# Altium schematic sheet Power_External.SchDoc
size A4
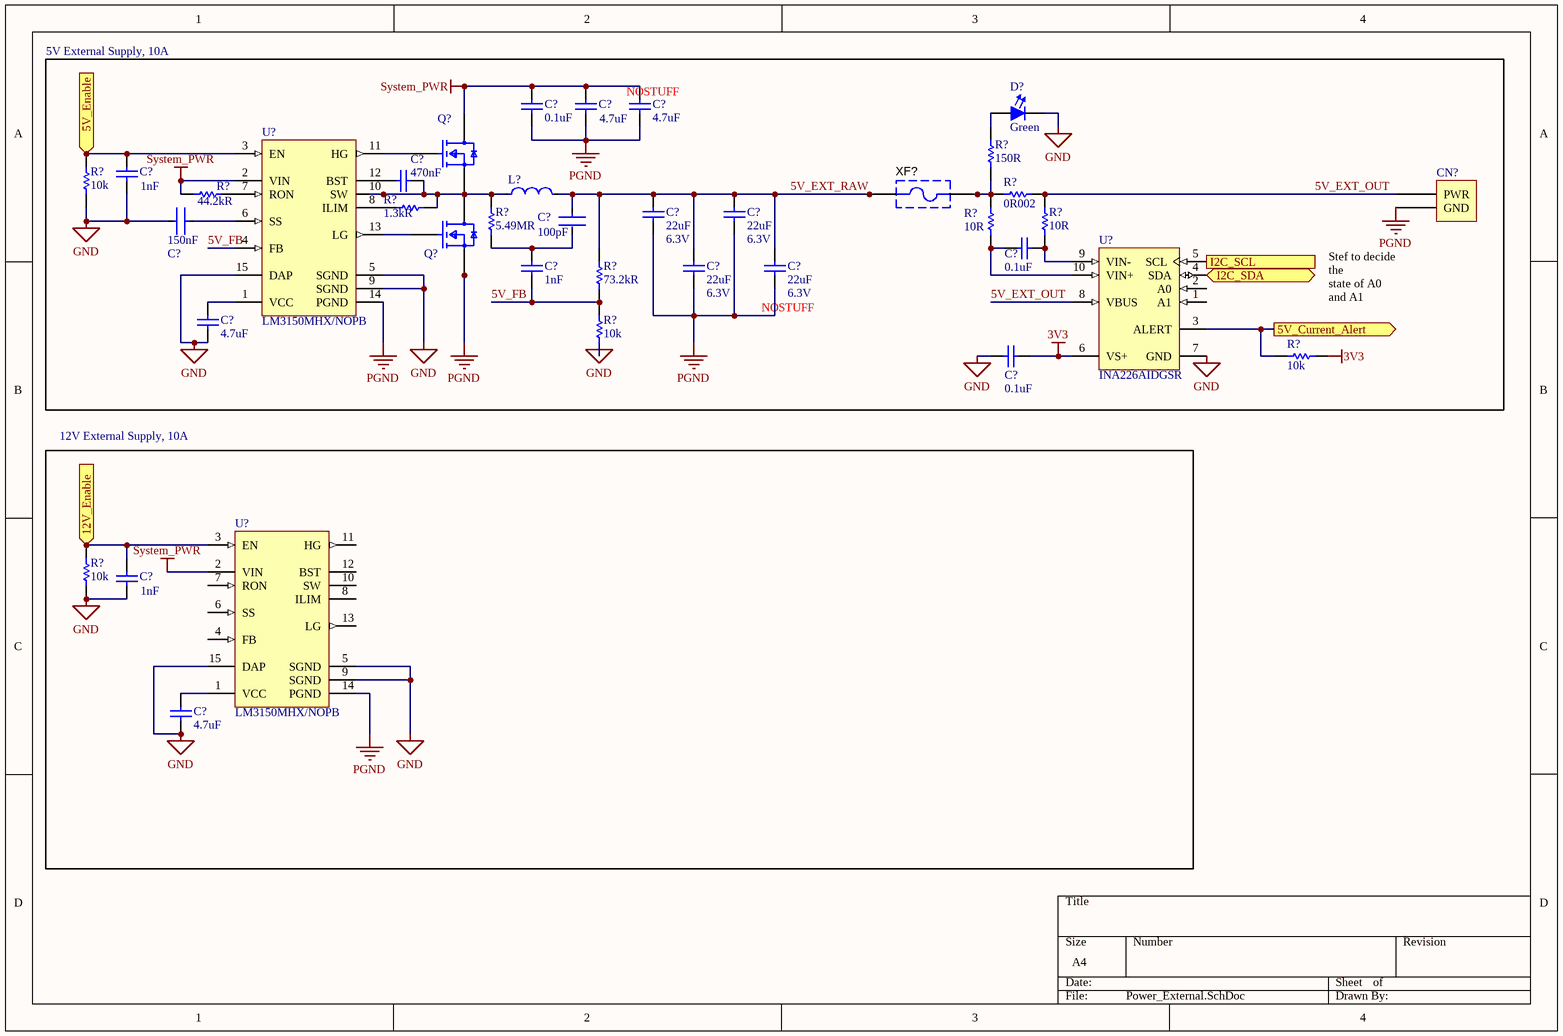
[diagram p0: Power_External.SchDoc]

## Parts
(Parts that share a designator on the sheet are numbered #1, #2 ... from top to bottom, then left to right.)
C?#1  Capacitance: 4.7uF  [CAPC3216X18N]  (hidden comment: CL31B475KBHNNNE)
C?#2  Capacitance: 4.7uF  [CAPC3216X18N]  (hidden comment: CL31B475KBHNNNE)
C?#3  Capacitance: 0.1uF  [FP-CL10-0_1-MFG]  (hidden comment: CL10B104JB8NNNC)
C?#4  Capacitance: 1nF  [CAPC1608X90X30LL10T20]  (hidden comment: CL10B102KB8NNNC)
C?#5  value 470nF  [CAPC1608N(0603")]  (hidden comment: 470nF, 50V, 10%, 0603, Ceramic, SMD)
C?#6  Capacitance: 100pF  [FP-CL10-IPC_B]  (hidden comment: CL10C101FB8NNNC)
C?#7  Capacitance: 22uF  Voltage Rating (DC): 6.3V  [CAPC1608X90X35LL10T15]  (hidden comment: GRM188R60J226MEA0D)
C?#8  Capacitance: 22uF  Voltage Rating (DC): 6.3V  [CAPC1608X90X35LL10T15]  (hidden comment: GRM188R60J226MEA0D)
C?#9  Capacitance: 150nF  [FP-CL21-IPC_B]  (hidden comment: CL21B154KBFNNNG)
C?#10  Capacitance: 0.1uF  [FP-CL10-0_1-MFG]  (hidden comment: CL10B104JB8NNNC)
C?#11  Capacitance: 22uF  Voltage Rating (DC): 6.3V  [CAPC1608X90X35LL10T15]  (hidden comment: GRM188R60J226MEA0D)
C?#12  Capacitance: 22uF  Voltage Rating (DC): 6.3V  [CAPC1608X90X35LL10T15]  (hidden comment: GRM188R60J226MEA0D)
C?#13  Capacitance: 1nF  [CAPC1608X90X30NL10T20]  (hidden comment: CL10B102KB8NNNC)
C?#14  Capacitance: 4.7uF  [CAPC3216X18N]  (hidden comment: CL31B475KBHNNNE)
C?#15  Capacitance: 0.1uF  [FP-CL10-0_1-MFG]  (hidden comment: CL10B104JB8NNNC)
C?#16  Capacitance: 1nF  [CAPC1608X90X30LL10T20]  (hidden comment: CL10B102KB8NNNC)
C?#17  Capacitance: 4.7uF  [CAPC3216X18N]  (hidden comment: CL31B475KBHNNNE)
CN?  Header, Female, 1x2, Right Angle, Pitch 0.118" (3.00mm), THT  [New footprint 1]  (value not drawn)
D?  Colour: Green  [LED0805]  (hidden comment: LED, 0805 (2012), Green, Clear)
L?  SRP1270-2R2M  [FP-SRP1270-MFG]  (value not drawn)
Q?#1  IPC50N04S5L5R5ATMA1  [FP-DQJ0008A-MFG]  (value not drawn)
Q?#2  IPC50N04S5L5R5ATMA1  [FP-DQJ0008A-MFG]  (value not drawn)
R?#1  value 10k  [RESC1608N(0603")]  (hidden comment: 10kR, 1%, 1/10W, 0603 SMD)
R?#2  Resistance: 150R  [RESC1609X50X30NL10T20]  (hidden comment: CRCW0603150RFKTA)
R?#3  Resistance: 44.2kR  [RESC1609X50X30NL10T20]  (hidden comment: CRCW060344K2FKEA)
R?#4  Resistance: 1.3kR  [RESC1609X50X30NL10T20]  (hidden comment: CRCW06031K30FKEA)
R?#5  Resistance: 5.49MR  [RESC1608N(0603")]  (hidden comment: CRCW06035M49FKEA)
R?#6  Resistance: 10R  [FP-ERJ3EK-IPC_A]  (hidden comment: ERJ3EKF10R0V)
R?#7  Resistance: 0R002  [RESC2716X08N]  (hidden comment: CSR1206-0R002F1)
R?#8  Resistance: 10R  [FP-ERJ3EK-IPC_A]  (hidden comment: ERJ3EKF10R0V)
R?#9  Resistance: 73.2kR  [RESC1608X55X30LL15T15]  (hidden comment: ERJ-3EKF7322V)
R?#10  value 10k  [RESC1608N(0603")]  (hidden comment: 10kR, 1%, 1/10W, 0603 SMD)
R?#11  value 10k  [RESC1608N(0603")]  (hidden comment: 10kR, 1%, 1/10W, 0603 SMD)
R?#12  value 10k  [RESC1608N(0603")]  (hidden comment: 10kR, 1%, 1/10W, 0603 SMD)
U?#1  LM3150MHX/NOPB  [PWP0014A_N]
U?#2  INA226AIDGSR  [DGS0010A_L]
U?#3  LM3150MHX/NOPB  [PWP0014A_N]
XF?  3557-2  [KSTN-3557-2]  (value not drawn)

## Blocks framed on the sheet
12V External Supply, 10A: C?#16 C?#17 R?#12 U?#3

## Ports
5V_Current_Alert (out), 5V_Enable (in), 12V_Enable (in), I2C_SCL (in), I2C_SDA (bidir)

## Nets
3V3: C?#15.1 R?#11.2 U?#2.6(VS+)
GND: C?#4.1 C?#9.2 C?#14.1 C?#15.2 C?#16.1 C?#17.1 D?.1(Cathode) R?#1.2 R?#10.2 R?#12.2 U?#1.5(SGND) U?#1.9(SGND) U?#1.15(DAP) U?#2.7(GND) U?#3.5(SGND) U?#3.9(SGND) U?#3.15(DAP)
PGND: C?#1.2 C?#2.2 C?#3.1 C?#7.2 C?#8.2 C?#11.2 C?#12.2 CN?.1(GND) Q?#2.1(S) Q?#2.2(S) Q?#2.3(S) U?#1.14(PGND) U?#3.14(PGND)
System_PWR: C?#1.1 C?#2.1 C?#3.2 Q?#1.5-6-7-8(D) R?#3.1 U?#1.2(VIN) U?#3.2(VIN)
5V_Current_Alert: R?#11.1 U?#2.3(ALERT) ; port 5V_Current_Alert
5V_Enable: C?#4.2 R?#1.1 U?#1.3(EN) ; port 5V_Enable
5V_EXT_OUT: CN?.2(PWR) R?#7.1 R?#8.1 U?#2.8(VBUS)
5V_EXT_RAW: C?#6.1 C?#7.1 C?#8.1 C?#11.1 C?#12.1 L?.2 R?#9.1 XF?.1 XF?.2
5V_FB: C?#13.1 R?#9.2 R?#10.1 U?#1.4(FB)
12V_Enable: C?#16.2 R?#12.1 U?#3.3(EN) ; port 12V_Enable
I2C_SCL: U?#2.5(SCL) ; port I2C_SCL
I2C_SDA: U?#2.4(SDA) ; port I2C_SDA
NetC?#5_1: C?#5.1(Anode) L?.1 Q?#1.1(S) Q?#1.2(S) Q?#1.3(S) Q?#2.5-6-7-8(D) R?#4.2 R?#5.1 U?#1.10(SW)
NetC?#5_2: C?#5.2(Cathode) U?#1.12(BST)
NetC?#6_2: C?#6.2 C?#13.2 R?#5.2
NetC?#9_1: C?#9.1 U?#1.6(SS)
NetC?#10_1: C?#10.1 R?#8.2 U?#2.9(VIN-)
NetC?#10_2: C?#10.2 R?#6.2 U?#2.10(VIN+)
NetC?#14_2: C?#14.2 U?#1.1(VCC)
NetC?#17_2: C?#17.2 U?#3.1(VCC)
NetD?_2: D?.2(Anode) R?#2.2
NetQ?#1_4: Q?#1.4(G) U?#1.11(HG)
NetQ?#2_4: Q?#2.4(G) U?#1.13(LG)
NetR?#2_1: R?#2.1 R?#6.1 R?#7.2 XF?.3 XF?.4
NetR?#3_2: R?#3.2 U?#1.7(RON)
NetR?#4_1: R?#4.1 U?#1.8(ILIM)

Not connected (* = marked no-connect by the designer): U?#2 1(A1) 2(A0); U?#3 4(FB) 6(SS) 7(RON) 8(ILIM) 10(SW) 11(HG) 12(BST) 13(LG)

## Notes on the sheet
- 5V External Supply, 10A
- (near C?#2) NOSTUFF
- (near C?#12) NOSTUFF
- Stef to decide the
  state of A0 and A1

## Library data of the parts
C?#1 C?#2 C?#14 C?#17 = CMP-00019-1: Capacitor 4.7 uF 50 VDC PU=2000 ST, CL31B475KBHNNNE, Samsung; Dielectric: X7R; Voltage: 50V; Tolerance: 10%; Thickness: 0.071inch; Case Code (Metric): 3216; Mount: Surface Mount; Packaging: Tape and Reel; Depth: 1.6mm; Package Quantity: 1; Voltage Rating: 50V; Radiation Hardening: No; Max Operating Temperature: 125°C; Min Operating Temperature: -55°C; Width: 0.063inch; Case/Package: 1206; Case Code (Imperial): 1206; Length: 3.2mm; Height: 1.6mm
C?#3 C?#10 C?#15 = CMP-00000-3: CAP CER 0.1UF 50V X7R 0603; Tolerance: 5%; Material: Ceramic; Case Code (Imperial): 0603; Mount: Surface Mount; Thickness: 0.035inch; Depth: 0.8mm; Packaging: Tape and Reel; Package Quantity: 1; Dielectric: X7R; Height: 0.8mm; Voltage: 50V; Radiation Hardening: No; Max Operating Temperature: 125°C; Voltage Rating: 50V; Case/Package: 0603; Min Operating Temperature: -55°C; Case Code (Metric): 1608; Length: 1.6mm; Contact Plating: Tin; Width: 0.031inch
C?#4 C?#13 C?#16 = CMP-00018-1: Cap Ceramic 0.001uF 50V X7R 10% Pad SMD 0603 125°C T/R; Tolerance: 10%; Case Code (Imperial): 0603; Packaging: Tape and Reel; Dielectric: X7R; Thickness: 0.035inch; Contact Plating: Tin; Min Operating Temperature: -55°C; Voltage Rating: 50V; Height: 0.8mm; Material: Ceramic; Width: 0.031inch; Max Operating Temperature: 125°C; Case/Package: 0603; Voltage Rating (DC): 50V; Case Code (Metric): 1608; Depth: 0.8mm; Radiation Hardening: No; Lead Free: Lead Free; Mount: Surface Mount; Voltage: 50V; Package Quantity: 1; Length: 1.6mm
C?#5 = CMP-006-0048-1: Capacitor, Ceramic, 50V, 10%, 0603 SMD, X7R; Made By: Ashwin Sira; Component Type: Standard; Publisher: AUVic; Design Item ID: 470nF, 50V, 10%, 0603, Ceramic, SMD; Date Created: 2016-06-25; Pin Count: 2; Source: AUVic_Schematic_Library_Capacitors.SchLib; PackageDescription: Chip Capacitor
C?#6 = CMP-00027-1: Ceramic capacitor SMD 0603 100 pF 50 V 1 %; Voltage Rating: 50V; Dielectric: C0G; Temperature Coefficient: 300ppm/°C; Tolerance: 1%; Radiation Hardening: No; Thickness: 0.035inch; Max Operating Temperature: 125°C; Voltage Rating (DC): 50V; Material: Ceramic; Min Operating Temperature: -55°C; Depth: 0.8mm; Voltage: 50V; Mount: Surface Mount; Case Code (Metric): 1608; Case Code (Imperial): 0603; Packaging: Tape and Reel; Case/Package: 0603; Height: 0.8mm; Package Quantity: 1; Width: 0.031inch; Length: 1.6mm
C?#7 C?#8 C?#11 C?#12 = CMP-00025-1: MURATA - GRM188R60J226MEA0D - SMD Multilayer Ceramic Capacitor, 22 µF, 6.3 V, 0603 [1608 Metric], ± 20%, X5R, GRM Series; Lead Free: Lead Free; Length: 1.6mm; Depth: 0.8mm; Dielectric: X5R; Tolerance: 20%; Width: 0.8mm; Termination: SMD/SMT; REACH SVHC: No SVHC; Height: 0.8mm; Weight: 0.000222oz; Thickness: 0.039inch; Package Quantity: 4000; Mount: Surface Mount; Min Operating Temperature: -55°C; Case Code (Metric): 1608; Case Code (Imperial): 0603; Voltage Rating: 6.3V; Max Operating Temperature: 85°C; Case/Package: 0603; Packaging: Tape and Reel
C?#9 = CMP-00020-1: CAP CER 0.15UF 50V X7R 0805; Tolerance: 10%; Material: Ceramic; Case Code (Imperial): 0805; Dielectric: X7R; Package Quantity: 3000; Max Operating Temperature: 125°C; Length: 2mm; Voltage Rating: 50V; Thickness: 0.053inch; Mount: Surface Mount; Height: 1.25mm; Width: 0.049inch; Packaging: Tape and Reel; Voltage: 50V; Radiation Hardening: No; Case Code (Metric): 2012; Depth: 1.25mm; Min Operating Temperature: -55°C; Case/Package: 0805; Lead Free: Lead Free
CN? = CMP-00001-4: Connector Header Through Hole, Right Angle 2 position; Gender: Male; Max Voltage Rating (DC): 250.25kV; Number of Contacts: 2; Current Rating: 5A; Glow Wire Compliant: Compliant; Voltage Rating: 600V; Voltage Rating (DC): 250V; Insulation Resistance: 1GR; Pitch: 3mm; Contact Resistance: 10mR; Length: 7.15mm; Contact Material: Brass; Housing Color: Black; Contact Plating: Gold; Packaging: Tray; Mount: Through Hole; Diameter: 3mm; Housing Material: Thermoplastic; Case/Package: SMC; Depth: 12.2mm; Termination: Solder; Color: Black; Max Current Rating: 5A; Number of Positions: 2; Lead Free: Contains Lead; Min Operating Temperature: -40°C; Number of Rows: 2; Height: 8.77mm; Package Quantity: 3168; Number of Circuits: 2; Max Operating Temperature: 105°C; Radiation Hardening: No; Flammability Rating: UL94 V-0; Orientation: Right Angle; Halogen Free: Low Halogen
D? = CMP-057-0009-1: Created By: Andy Bates; Pin Count: 2; Design Item ID: LED, 0805 (2012), Green, Clear; Source: AUVic_Schematic_Library_Diodes.SchLib; Component Type: Standard
L? = CMP-00024-1: BOURNS         SRP1270-2R2M             Surface Mount Power Inductor, SRP1270 Series, 2.2 H, 22 A, 40 A, Shielded, 4200 ohm; Current: 46A; DC Current: 22A; Inductance Tolerance: 20%; Core Material: Ferrite; Inductance: 2.2uH; DC Resistance (DCR): 4.2mR; Self Resonant Frequency: 25MHz; Saturation Current: 40A; Test Frequency: 100kHz; Number of Pins: 2; REACH SVHC: No SVHC; Packaging: Tape and Reel; Military Standard: Not; Depth: 13.7mm; Shielding: Shielded; Min Operating Temperature: -55°C; Height - Seated (Max): 0.276inch; Height: 7mm; Composition: Wirewound; Tolerance: 20%; Width: 13.7mm; Mount: Surface Mount; Termination: SMD/SMT; Case/Package: Nonstandard; Package Quantity: 400; Max Operating Temperature: 125°C; RMS Current (Irms): 22A; Length: 13.7mm; Current Rating: 22A; Max DC Current: 22A
Q?#1 Q?#2 = CMP-00023-2: N-CHANNEL_30/40V; Rds On Max: 5.5mR; Max Dual Supply Voltage: 40V; Number of Levels: 1; Wire Gauge (Min): 18AWG; Wire Gauge (Max): 28AWG; Input Capacitance: 1.209nF; Number of Positions Per Level: 3; Max Power Dissipation: 42W; Color: Grey; Plating: Steel; Continuous Drain Current (ID): 50A; Drain to Source Voltage (Vdss): 40V; Max Operating Temperature: 175°C; Halogen Free: Halogen Free; Lead Free: Contains Lead; Housing Material: Nylon; Number of Pins: 8; Contact Plating: Tin; Min Operating Temperature: -55°C; Packaging: Cut Tape; Mount: Surface Mount,Through Hole
R?#1 R?#10-R?#12 = CMP-047-0013-1: Owned By: AUVic; Made By: Ashwin Sira; Design Item ID: 10kR, 1%, 1/10W, 0603 SMD; Pin Count: 2; Component Type: Standard; Created On: 14-05-31; Last Edited: 14-05-31; Source: AUVic_Schematic_Library_Resistors.SchLib
R?#2 = CMP-00033-1: Res Thick Film 0603 150 Ohm 1% 1/10W 100ppm/C Molded SMD SMD Paper T/R; Power Rating: 100mW; Voltage Rating: 75V; Temperature Coefficient: 100ppm/°C; Contact Plating: Tin,Lead; Power Dissipation: 100mW; Package Quantity: 5000; Case Code (Metric): 1608; Length: 1.55mm; Max Operating Temperature: 155°C; Mount: Surface Mount; Features: Automotive AEC-Q200; Width: 0.033inch; Lead Free: Contains Lead; Number of Terminations: 2; Voltage Rating (DC): 75V; Case/Package: 0603; Case Code (Imperial): 0603; Packaging: Tape and Reel; Tolerance: 1%; Number of Pins: 2; Height: 0.02inch; Military Standard: Not; Radiation Hardening: No; Weight: 7.1E-05oz; Min Operating Temperature: -55°C; REACH SVHC: Unknown; Max Power Dissipation: 100mW; Termination: SMD/SMT; Depth: 0.85mm; Composition: Thick Film
R?#3 = CMP-00021-1: Res Thick Film 0603 44.2K Ohm 1% 0.1W(1/10W) ±100ppm/C Pad SMD Automotive T/R; Max Power Dissipation: 100mW; Voltage Rating: 75V; Temperature Coefficient: 100ppm/°C; Width: 0.85mm; Case Code (Metric): 1608; Radiation Hardening: No; Military Standard: Not; Depth: 0.85mm; Tolerance: 1%; Min Operating Temperature: -55°C; Case Code (Imperial): 0603; Contact Plating: Tin; REACH SVHC: Unknown; Termination: SMD/SMT; Power Rating: 100mW; Composition: Thick Film; Lead Free: Lead Free; Weight: 7.1E-05oz; Max Operating Temperature: 155°C; Height: 0.45mm; Features: Automotive AEC-Q200; Package Quantity: 10; Packaging: Tape and Reel; Number of Terminations: 2; Length: 1.55mm; Voltage Rating (DC): 75V; Case/Package: 0603
R?#4 = CMP-00026-1: Res Thick Film 0603 1.3K Ohm 1% 1/10W 100ppm/C Molded SMD SMD Paper T/R; Voltage Rating (DC): 75V; Power Rating: 100mW; Temperature Coefficient: 100ppm/°C; Depth: 0.85mm; Military Standard: Not; Composition: Thick Film; Case Code (Metric): 1608; Lead Free: Lead Free; Case/Package: 0603; Packaging: Tape and Reel; Max Operating Temperature: 155°C; Voltage Rating: 75V; Tolerance: 1%; Height: 0.45mm; Package Quantity: 5000; Case Code (Imperial): 0603; Width: 0.85mm; Length: 1.55mm; REACH SVHC: Unknown; Termination: SMD/SMT; Radiation Hardening: No; Contact Plating: Tin; Weight: 7.1E-05oz; Number of Pins: 2; Min Operating Temperature: -55°C
R?#5 = CMP-00028-1: RES SMD 5.49M OHM 1% 1/10W 0603; Voltage Rating: 75V; Temperature Coefficient: 100ppm/°C; Max Power Dissipation: 100mW; Termination: SMD/SMT; Depth: 0.85mm; Composition: Thick Film; Max Operating Temperature: 155°C; Package Quantity: 10; Contact Plating: Tin; Width: 0.033inch; Lead Free: Lead Free; Length: 1.55mm; Number of Terminations: 2; Min Operating Temperature: -55°C; Weight: 7.1E-05oz; Case Code (Imperial): 0603; REACH SVHC: Unknown; Number of Pins: 2; Military Standard: Not; Power Rating: 100mW; Features: Automotive AEC-Q200; Tolerance: 1%; Voltage Rating (DC): 75V; Height: 0.02inch; Packaging: Tape and Reel; Case/Package: 0603; Radiation Hardening: No; Case Code (Metric): 1608
R?#6 R?#8 = CMP-00034-2: PANASONIC - ERJ3EKF10R0V - SMD Chip Resistor, 0603 [1608 Metric], 10 ohm, ERJ3EK Series, 75 V, Thick Film, 100 mW; Temperature Coefficient: 100ppm/°C; Tolerance: 1%; Max Power Dissipation: 100mW; Voltage Rating (DC): 75V; Package Quantity: 5000; Case Code (Imperial): 0603; Military Standard: Not; Depth: 0.8mm; Number of Terminations: 2; Working Voltage: 75V; Min Operating Temperature: -55°C; Width: 0.8mm; Composition: Thick Film; Packaging: Tape and Reel; Power Rating: 100mW; REACH SVHC: No SVHC; Max Operating Temperature: 155°C; Case Code (Metric): 1608; Features: Automotive AEC-Q200; Case/Package: 0603; Length: 1.6mm; Number of Pins: 2; Lead Free: Lead Free; Height: 0.45mm; Voltage Rating: 75V; Contact Plating: Tin; Termination: SMD/SMT; Mount: Surface Mount; Radiation Hardening: No
R?#7 = CMP-00031-1: RES 0.002 OHM 1W 1% 1206; Temperature Coefficient: 50ppm/°C; Number of Terminations: 2; Composition: Metal Element; Case Code (Metric): 3216; Min Operating Temperature: -55°C; Length: 0.126inch; Tolerance: 1%; Packaging: Tape and Reel; Max Power Dissipation: 1W; Width: 0.063inch; Package Quantity: 1; Max Operating Temperature: 170°C; Height: 0.024inch; Case/Package: 1206; Case Code (Imperial): 1206
R?#9 = CMP-00029-1: Res Thick Film 0603 73.2K Ohm 1% 0.1W(1/10W) ±100ppm/C Pad SMD Automotive T/R; Max Power Dissipation: 100mW; Voltage Rating (DC): 50V; Temperature Coefficient: 100ppm/°C; Voltage Rating: 75V; Packaging: Tape and Reel; REACH SVHC: No SVHC; Case Code (Imperial): 0603; Mount: Surface Mount; Height: 0.022inch; Military Standard: Not; Features: Automotive AEC-Q200; Power Rating: 100mW; Width: 0.031inch; Termination: SMD/SMT; Number of Terminations: 2; Composition: Thick Film; Length: 1.6mm; Depth: 0.8mm; Min Operating Temperature: -55°C; Package Quantity: 1; Max Operating Temperature: 155°C; Case/Package: 0603; Case Code (Metric): 1608; Tolerance: 1%; Radiation Hardening: No; Contact Plating: Tin; Lead Free: Lead Free
U?#1 U?#3 = CMP-00012-1: IC REG CTRLR BUCK 14TSSOP; Max Supply Voltage: 42V; Quiescent Current: 3.5mA; Max Duty Cycle: 96%; Duty Cycle: 95%; Max Frequency: 1MHz; Output Voltage: 600mV; Min Supply Voltage: 6V; Output Current: 12A; Number of Outputs: 1; Lead Free: Lead Free; Min Operating Temperature: -40°C; REACH SVHC: No SVHC; Package Quantity: 2500; Max Operating Temperature: 125°C; Switching Frequency: 1MHz; Radiation Hardening: No; Features: UVLO; Case/Package: TSSOP; Contact Plating: Tin,Matte; Packaging: Tape and Reel; Number of Pins: 14; Mount: Surface Mount
U?#2 = CMP-00032-1: Bi Directional Current and Power Monitor 10-Pin VSSOP T/R; Nominal Supply Current: 330uA; Common Mode Rejection Ratio: 140dB; Output Current: 10mA; Accuracy: 0.02%; Input Bias Current: 10uA; Input Offset Voltage (Vos): 2.5uV; Min Supply Voltage: 2.7V; Max Supply Voltage: 5.5V; Mount: Surface Mount; Case/Package: VSSOP; Contact Plating: Gold; Radiation Hardening: No; Packaging: Tape and Reel; Package Quantity: 1; Max Operating Temperature: 125°C; Lead Free: Lead Free; Number of Pins: 10; Min Operating Temperature: -40°C; REACH SVHC: No SVHC
XF? = CMP-00030-2: Fuse Holder; Auto; 2 in1 Blade; THM; 1 Fuse; Vertical; 30 Amps; Current Rating: 20A; Voltage Rating (AC): 500V; Number of Poles: 1; Illumination Type: Illuminated; Fuse Type: Automotive; REACH SVHC: No SVHC; Lead Free: Lead Free; Max Operating Temperature: 145°C; Fuse Current: 20A; Min Operating Temperature: -50°C; Voltage: 500V; Contact Material: Brass; Orientation: Vertical; Package Quantity: 1; Depth: 6.8mm; Flammability Rating: UL94 V-0; Color: Black; Contact Plating: Tin; Termination: PC Pin; Material: Brass,Tin,Nylon; Number of Circuits: 1; Mount: Vertical,PCB; Length: 19.8mm